# EAGLE design PowerBar (EAGLE 6.5.0)
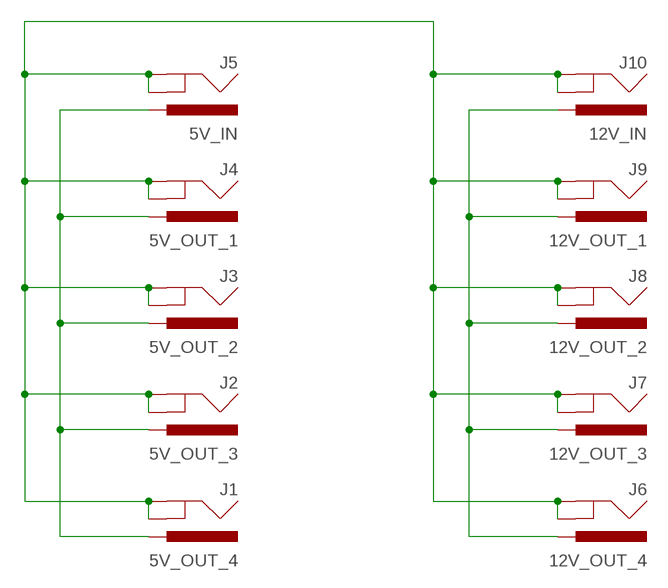
[diagram p0: schematic, sheet 1]

## Parts
J1  5V_OUT_4  POWER_JACKPTH  [POWER_JACK_PTH]
J2  5V_OUT_3  POWER_JACKPTH  [POWER_JACK_PTH]
J3  5V_OUT_2  POWER_JACKPTH  [POWER_JACK_PTH]
J4  5V_OUT_1  POWER_JACKPTH  [POWER_JACK_PTH]
J5  5V_IN  POWER_JACKPTH  [POWER_JACK_PTH]
J6  12V_OUT_4  POWER_JACKPTH  [POWER_JACK_PTH]
J7  12V_OUT_3  POWER_JACKPTH  [POWER_JACK_PTH]
J8  12V_OUT_2  POWER_JACKPTH  [POWER_JACK_PTH]
J9  12V_OUT_1  POWER_JACKPTH  [POWER_JACK_PTH]
J10  12V_IN  POWER_JACKPTH  [POWER_JACK_PTH]

## Nets
N$1: J1.GND J1.GNDBREAK J2.GND J2.GNDBREAK J3.GND J3.GNDBREAK J4.GND J4.GNDBREAK J5.GND J5.GNDBREAK J6.GND J6.GNDBREAK J7.GND J7.GNDBREAK J8.GND J8.GNDBREAK J9.GND J9.GNDBREAK J10.GND J10.GNDBREAK
N$2: J1.PWR J2.PWR J3.PWR J4.PWR J5.PWR
N$4: J6.PWR J7.PWR J8.PWR J9.PWR J10.PWR

## Library data of the parts
J1-J10 = SparkFun-Connectors:POWER_JACK: Power Jack This is the standard 5.5mm barrel jack for power. The PTH is the most common, proven, reliable, footprint. The Slot footprint only works if the mill layer is transmitted to the PCB fab house so be warned. Spark Fun Electronics SKU : PRT-00119 SMT: CONN-08106 Mating wall wart : TOL-00298 (and others)

## Board
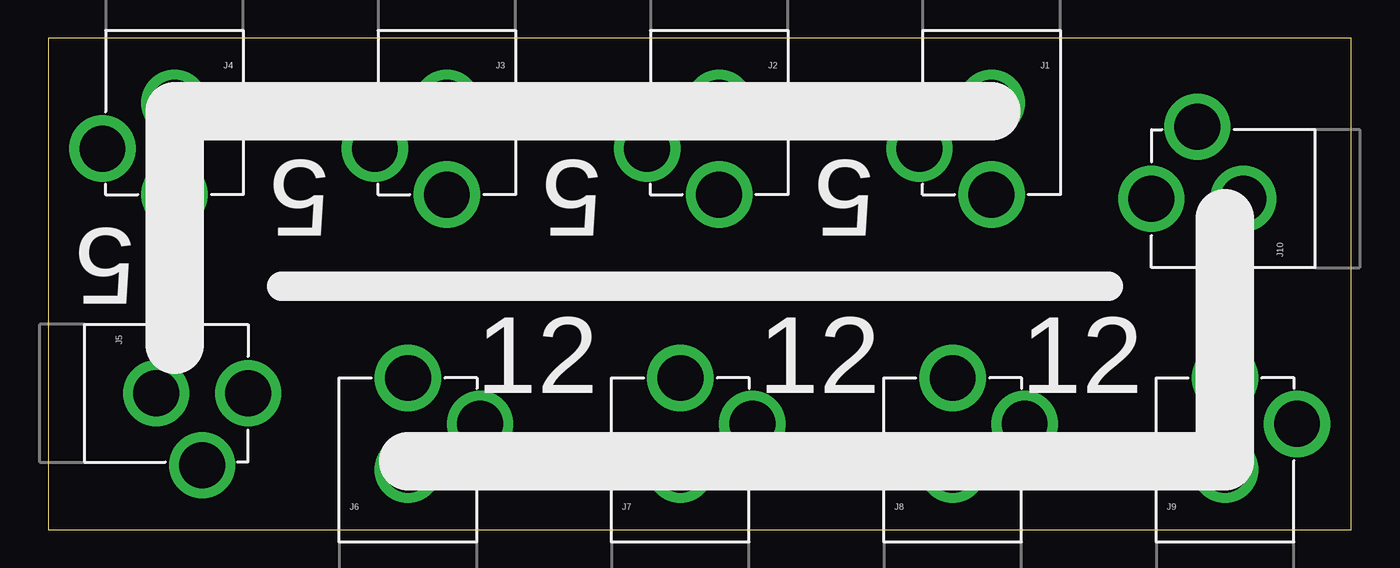
[diagram p1: board, top side]
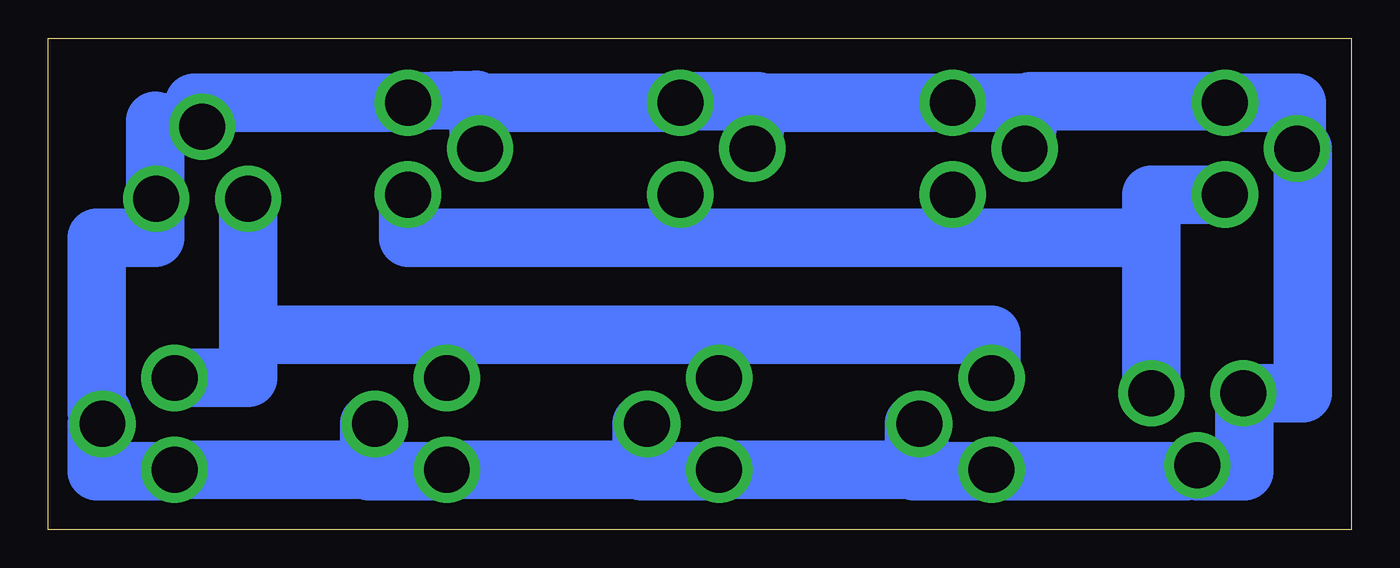
[diagram p2: board, bottom side, seen from below]

Size 85.07 x 32.05 mm. Coordinates in mm from the lower left corner, seen from the top.
Outline: 0,0 85.07,0 85.07,32.05 0,32.05 0,0
Copper layers (1*16): Top 0.035mm / dielectric 1.5mm / Bottom 0.035mm
Design rules "default": minimum track width 10mil, minimum drill 24mil, track to track 8mil, track to pad 8mil, pad to pad 8mil, via to via 8mil, smd to smd 8mil, copper to edge 40mil, drill to drill 8mil, minimum pad ring 10mil, minimum via ring 8mil, stop-mask expansion 4mil, vias tented up to drill 0mil, thermal gap 10mil

### Footprints (pad centres in the part's own frame; a part is rotated, then mirrored left to right if it is on the bottom)
POWER_JACK_PTH = drill 2.997 pad 4.318: GND 0,7.7; GNDBREAK 4.7,10.7; PWR 0,13.7

### Placement (x,y rotation side)
J1  61.59,35.56 180 top
J2  43.81,35.56 180 top
J3  26.04,35.56 180 top
J4  8.26,35.56 180 top
J5  -0.64,8.89 270 top
J6  23.5,-3.81 0 top
J7  41.27,-3.81 0 top
J8  59.05,-3.81 0 top
J9  76.83,-3.81 0 top
J10  85.72,21.59 90 top

### Tracks (layer width: path | path; a pad name or v marks a point on that pad's centre or on a via)
N$1
  Bottom 3.81: J5.GNDBREAK 10.06,3.81 6.99,3.81 6.99,8.89 J5.GND 3.17,8.89 3.17,24.86 J4.GNDBREAK 3.56,27.86 J4.GND 8.26,27.94 20.95,27.94 20.95,27.4 J3.GNDBREAK 21.34,27.86 J3.GND 39.12,27.86 J2.GNDBREAK 38.73,27.4 38.73,27.94 43.81,27.94 J2.GND 56.9,27.86 J1.GNDBREAK 57.15,28.04 61.59,27.94 J1.GND 75.56,27.86 75.56,26.29 | 78.11,21.59 78.11,26.67 75.56,26.29 | J10.GNDBREAK 75.56,26.29 | 23.5,3.81 28.57,3.81 28.57,6.89 J6.GNDBREAK 28.2,3.89 J7.GND 41.27,3.81 46.35,3.81 46.35,6.89 J7.GNDBREAK 45.98,6.35 46.35,6.35 46.35,3.89 J8.GND 59.05,3.81 64.14,3.81 64.14,6.89 J8.GNDBREAK 63.76,3.89 J9.GND 76.83,3.81 81.92,3.81 81.92,6.89 J9.GNDBREAK 81.53,7.62 81.92,7.62 81.92,19.05 78.11,19.05 78.11,21.59 | 23.5,3.81 J6.GND | 23.5,3.81 10.79,3.81 | J10.GND 78.11,21.59
N$2
  Bottom 3.81: J4.PWR 13.06,21.86 13.06,19.05 | 13.06,19.05 J5.PWR | J1.PWR 61.59,19.05 43.81,19.05 | 26.04,19.05 43.81,19.05 | 43.81,19.05 J2.PWR | J3.PWR 26.04,19.05 | 26.04,19.05 13.06,19.05
N$4
  Bottom 3.81: J9.PWR 72.03,9.89 72.03,12.7 | 72.03,12.7 J10.PWR | 59.05,12.7 41.27,12.7 | J7.PWR 41.27,12.7 | 41.27,12.7 23.5,12.7 J6.PWR | J8.PWR 59.05,12.7 | 59.05,12.7 72.03,12.7

### Text on the board
tNames: 5 | 5 | 5 | 5 | 12 | 12 | 12